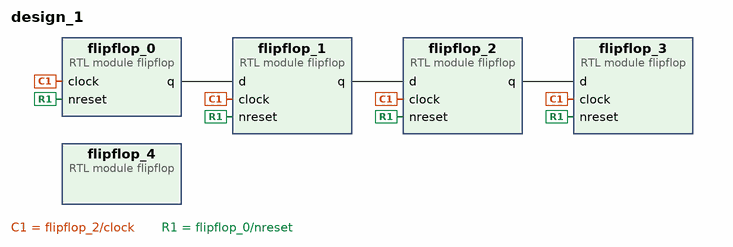
[diagram p0: block diagram of the top level]
# Vivado block design design_1, xc7a35ticpg236-1L, Vivado 2018.3
create_bd_design design_1

create_bd_cell -type module -reference flipflop flipflop_0
create_bd_cell -type module -reference flipflop flipflop_1
create_bd_cell -type module -reference flipflop flipflop_2
create_bd_cell -type module -reference flipflop flipflop_3
create_bd_cell -type module -reference flipflop flipflop_4

# ---- connections ----

connect_bd_net [get_bd_pins flipflop_0/q] [get_bd_pins flipflop_1/d]
connect_bd_net -net flipflop_0_q1 [get_bd_pins flipflop_2/q] [get_bd_pins flipflop_3/d]
connect_bd_net [get_bd_pins flipflop_2/clock] [get_bd_pins flipflop_3/clock] [get_bd_pins flipflop_0/clock] [get_bd_pins flipflop_1/clock]
connect_bd_net [get_bd_pins flipflop_1/q] [get_bd_pins flipflop_2/d]
connect_bd_net [get_bd_pins flipflop_0/nreset] [get_bd_pins flipflop_1/nreset] [get_bd_pins flipflop_2/nreset] [get_bd_pins flipflop_3/nreset]

validate_bd_design
save_bd_design
